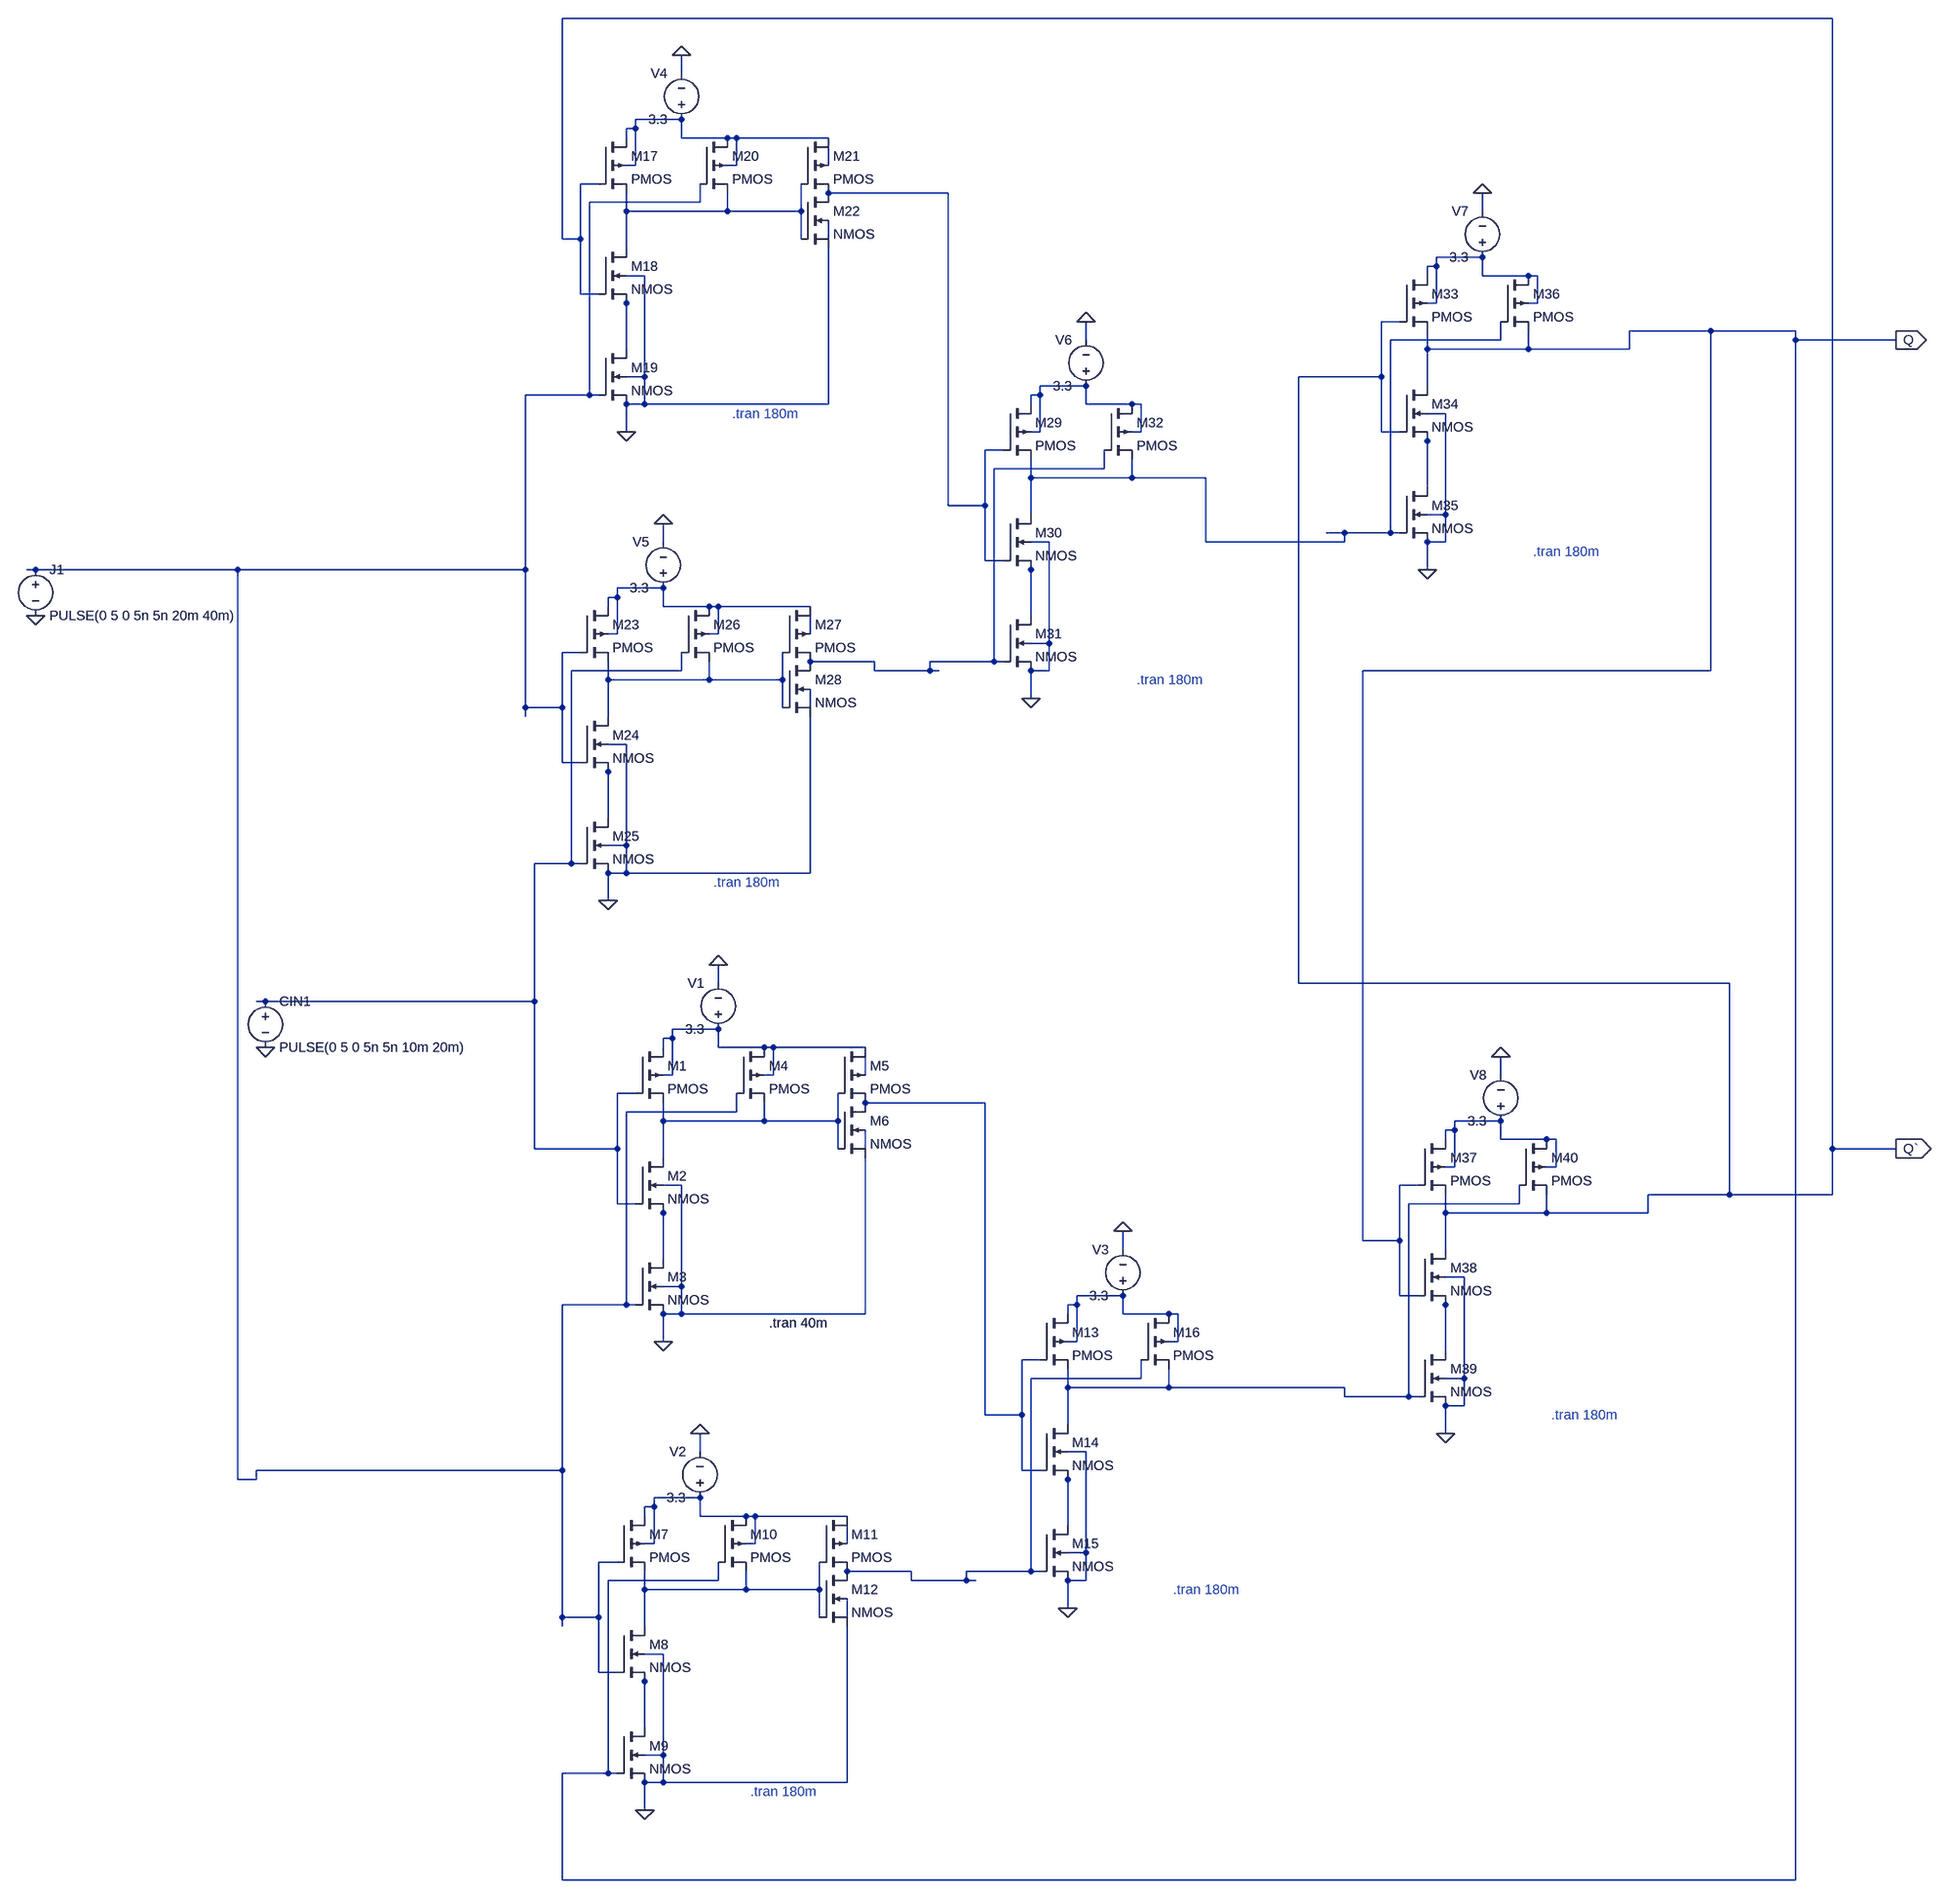
[diagram p0: schematic TFF.asc]
TFF.asc, the LTspice schematic file:
Version 4
SHEET 1 880 3060
WIRE -384 -304 -2832 -304
WIRE -2624 -208 -2624 -240
WIRE -2624 -128 -2704 -128
WIRE -2704 -112 -2704 -128
WIRE -2704 -112 -2720 -112
WIRE -2720 -96 -2720 -112
WIRE -2624 -96 -2624 -128
WIRE -2544 -96 -2624 -96
WIRE -2528 -96 -2544 -96
WIRE -2368 -96 -2528 -96
WIRE -2704 -48 -2704 -112
WIRE -2704 -48 -2720 -48
WIRE -2528 -48 -2528 -96
WIRE -2528 -48 -2544 -48
WIRE -2368 -48 -2368 -80
WIRE -2768 -16 -2800 -16
WIRE -2160 0 -2368 0
WIRE -2592 16 -2592 -16
WIRE -2592 16 -2784 16
WIRE -2720 32 -2720 0
WIRE -2544 32 -2544 0
WIRE -2544 32 -2720 32
WIRE -2416 32 -2416 -16
WIRE -2416 32 -2544 32
WIRE -1120 32 -1120 0
WIRE -2832 80 -2832 -304
WIRE -2800 80 -2800 -16
WIRE -2800 80 -2832 80
WIRE -2416 80 -2416 32
WIRE -2368 80 -2368 48
WIRE -2720 96 -2720 32
WIRE -1120 112 -1200 112
WIRE -1200 128 -1200 112
WIRE -1200 128 -1216 128
WIRE -2688 144 -2720 144
WIRE -1216 144 -1216 128
WIRE -1120 144 -1120 112
WIRE -1040 144 -1120 144
WIRE -1024 144 -1040 144
WIRE -2800 176 -2800 80
WIRE -2768 176 -2800 176
WIRE -2720 192 -2720 176
WIRE -1200 192 -1200 128
WIRE -1200 192 -1216 192
WIRE -1024 192 -1024 144
WIRE -1024 192 -1040 192
WIRE -1264 224 -1296 224
WIRE -624 240 -864 240
WIRE -448 240 -624 240
WIRE -1920 256 -1920 224
WIRE -1088 256 -1088 224
WIRE -1088 256 -1280 256
WIRE -448 256 -448 240
WIRE -192 256 -448 256
WIRE -2720 272 -2720 192
WIRE -1216 272 -1216 240
WIRE -1040 272 -1040 240
WIRE -1040 272 -1216 272
WIRE -864 272 -864 240
WIRE -864 272 -1040 272
WIRE -2688 320 -2688 144
WIRE -2688 320 -2720 320
WIRE -1296 320 -1296 224
WIRE -1296 320 -1440 320
WIRE -1920 336 -2000 336
WIRE -1216 336 -1216 272
WIRE -2784 352 -2784 16
WIRE -2784 352 -2896 352
WIRE -2768 352 -2784 352
WIRE -2000 352 -2000 336
WIRE -2000 352 -2016 352
WIRE -2688 368 -2688 320
WIRE -2688 368 -2720 368
WIRE -2368 368 -2368 96
WIRE -2368 368 -2688 368
WIRE -2016 368 -2016 352
WIRE -1920 368 -1920 336
WIRE -1840 368 -1920 368
WIRE -1824 368 -1840 368
WIRE -1184 384 -1216 384
WIRE -2720 416 -2720 368
WIRE -2000 416 -2000 352
WIRE -2000 416 -2016 416
WIRE -1824 416 -1824 368
WIRE -1824 416 -1840 416
WIRE -1296 416 -1296 320
WIRE -1264 416 -1296 416
WIRE -1216 432 -1216 416
WIRE -2064 448 -2096 448
WIRE -1888 480 -1888 448
WIRE -1888 480 -2080 480
WIRE -2016 496 -2016 464
WIRE -1840 496 -1840 464
WIRE -1840 496 -2016 496
WIRE -1712 496 -1840 496
WIRE -1216 512 -1216 432
WIRE -2160 544 -2160 0
WIRE -2096 544 -2096 448
WIRE -2096 544 -2160 544
WIRE -2016 560 -2016 496
WIRE -1184 560 -1184 384
WIRE -1184 560 -1216 560
WIRE -1360 592 -1392 592
WIRE -1280 592 -1280 256
WIRE -1280 592 -1360 592
WIRE -1264 592 -1280 592
WIRE -2656 608 -2656 576
WIRE -1984 608 -2016 608
WIRE -1712 608 -1712 496
WIRE -1360 608 -1360 592
WIRE -1360 608 -1712 608
WIRE -1184 608 -1184 560
WIRE -1184 608 -1216 608
WIRE -2096 640 -2096 544
WIRE -2064 640 -2096 640
WIRE -3840 656 -3856 656
WIRE -3488 656 -3840 656
WIRE -2896 656 -2896 352
WIRE -2896 656 -3488 656
WIRE -2016 656 -2016 640
WIRE -1216 656 -1216 608
WIRE -2656 688 -2736 688
WIRE -2736 704 -2736 688
WIRE -2736 704 -2752 704
WIRE -2752 720 -2752 704
WIRE -2656 720 -2656 688
WIRE -2576 720 -2656 720
WIRE -2560 720 -2576 720
WIRE -2400 720 -2560 720
WIRE -2016 736 -2016 656
WIRE -2736 768 -2736 704
WIRE -2736 768 -2752 768
WIRE -2560 768 -2560 720
WIRE -2560 768 -2576 768
WIRE -2400 768 -2400 736
WIRE -1984 784 -1984 608
WIRE -1984 784 -2016 784
WIRE -2800 800 -2832 800
WIRE -2288 816 -2400 816
WIRE -2080 816 -2080 480
WIRE -2080 816 -2192 816
WIRE -2064 816 -2080 816
WIRE -2624 832 -2624 800
WIRE -2624 832 -2816 832
WIRE -2288 832 -2288 816
WIRE -2192 832 -2192 816
WIRE -2192 832 -2288 832
WIRE -2176 832 -2192 832
WIRE -1984 832 -1984 784
WIRE -1984 832 -2016 832
WIRE -624 832 -624 240
WIRE -624 832 -1328 832
WIRE -2752 848 -2752 816
WIRE -2576 848 -2576 816
WIRE -2576 848 -2752 848
WIRE -2448 848 -2448 800
WIRE -2448 848 -2576 848
WIRE -2016 880 -2016 832
WIRE -2896 896 -2896 656
WIRE -2832 896 -2832 800
WIRE -2832 896 -2896 896
WIRE -2448 896 -2448 848
WIRE -2400 896 -2400 864
WIRE -2896 912 -2896 896
WIRE -2752 912 -2752 848
WIRE -2720 960 -2752 960
WIRE -2832 992 -2832 896
WIRE -2800 992 -2832 992
WIRE -2752 1008 -2752 992
WIRE -2752 1088 -2752 1008
WIRE -2720 1136 -2720 960
WIRE -2720 1136 -2752 1136
WIRE -2816 1168 -2816 832
WIRE -2816 1168 -2880 1168
WIRE -2800 1168 -2816 1168
WIRE -2720 1184 -2720 1136
WIRE -2720 1184 -2752 1184
WIRE -2400 1184 -2400 912
WIRE -2400 1184 -2720 1184
WIRE -2752 1232 -2752 1184
WIRE -2560 1376 -2560 1344
WIRE -1440 1376 -1440 320
WIRE -592 1376 -1440 1376
WIRE -3440 1408 -3456 1408
WIRE -2880 1408 -2880 1168
WIRE -2880 1408 -3440 1408
WIRE -2560 1456 -2640 1456
WIRE -2640 1472 -2640 1456
WIRE -2640 1472 -2656 1472
WIRE -2656 1488 -2656 1472
WIRE -2560 1488 -2560 1456
WIRE -2480 1488 -2560 1488
WIRE -2464 1488 -2480 1488
WIRE -2304 1488 -2464 1488
WIRE -2640 1536 -2640 1472
WIRE -2640 1536 -2656 1536
WIRE -2464 1536 -2464 1488
WIRE -2464 1536 -2480 1536
WIRE -2304 1536 -2304 1504
WIRE -1088 1536 -1088 1504
WIRE -2704 1568 -2736 1568
WIRE -2096 1584 -2304 1584
WIRE -2528 1600 -2528 1568
WIRE -2528 1600 -2720 1600
WIRE -2656 1616 -2656 1584
WIRE -2480 1616 -2480 1584
WIRE -2480 1616 -2656 1616
WIRE -2352 1616 -2352 1568
WIRE -2352 1616 -2480 1616
WIRE -1088 1616 -1168 1616
WIRE -1168 1632 -1168 1616
WIRE -1168 1632 -1184 1632
WIRE -1184 1648 -1184 1632
WIRE -1088 1648 -1088 1616
WIRE -1008 1648 -1088 1648
WIRE -992 1648 -1008 1648
WIRE -2880 1664 -2880 1408
WIRE -2736 1664 -2736 1568
WIRE -2736 1664 -2880 1664
WIRE -2352 1664 -2352 1616
WIRE -2304 1664 -2304 1632
WIRE -384 1664 -384 -304
WIRE -192 1664 -384 1664
WIRE -2656 1680 -2656 1616
WIRE -1168 1696 -1168 1632
WIRE -1168 1696 -1184 1696
WIRE -992 1696 -992 1648
WIRE -992 1696 -1008 1696
WIRE -2624 1728 -2656 1728
WIRE -1232 1728 -1264 1728
WIRE -592 1744 -592 1376
WIRE -592 1744 -832 1744
WIRE -384 1744 -384 1664
WIRE -384 1744 -592 1744
WIRE -2736 1760 -2736 1664
WIRE -2704 1760 -2736 1760
WIRE -1056 1760 -1056 1728
WIRE -1056 1760 -1248 1760
WIRE -2656 1776 -2656 1760
WIRE -1184 1776 -1184 1744
WIRE -1008 1776 -1008 1744
WIRE -1008 1776 -1184 1776
WIRE -832 1776 -832 1744
WIRE -832 1776 -1008 1776
WIRE -1328 1824 -1328 832
WIRE -1264 1824 -1264 1728
WIRE -1264 1824 -1328 1824
WIRE -1856 1840 -1856 1808
WIRE -1184 1840 -1184 1776
WIRE -2656 1856 -2656 1776
WIRE -1152 1888 -1184 1888
WIRE -2624 1904 -2624 1728
WIRE -2624 1904 -2656 1904
WIRE -1856 1920 -1936 1920
WIRE -1264 1920 -1264 1824
WIRE -1232 1920 -1264 1920
WIRE -2720 1936 -2720 1600
WIRE -2720 1936 -2832 1936
WIRE -2704 1936 -2720 1936
WIRE -1936 1936 -1936 1920
WIRE -1936 1936 -1952 1936
WIRE -1184 1936 -1184 1920
WIRE -2624 1952 -2624 1904
WIRE -2624 1952 -2656 1952
WIRE -2304 1952 -2304 1680
WIRE -2304 1952 -2624 1952
WIRE -1952 1952 -1952 1936
WIRE -1856 1952 -1856 1920
WIRE -1776 1952 -1856 1952
WIRE -1760 1952 -1776 1952
WIRE -2656 2000 -2656 1952
WIRE -1936 2000 -1936 1936
WIRE -1936 2000 -1952 2000
WIRE -1760 2000 -1760 1952
WIRE -1760 2000 -1776 2000
WIRE -1184 2016 -1184 1936
WIRE -2000 2032 -2032 2032
WIRE -1824 2064 -1824 2032
WIRE -1824 2064 -2016 2064
WIRE -1152 2064 -1152 1888
WIRE -1152 2064 -1184 2064
WIRE -1952 2080 -1952 2048
WIRE -1776 2080 -1776 2048
WIRE -1776 2080 -1952 2080
WIRE -1360 2080 -1776 2080
WIRE -1360 2096 -1360 2080
WIRE -1248 2096 -1248 1760
WIRE -1248 2096 -1360 2096
WIRE -1232 2096 -1248 2096
WIRE -1152 2112 -1152 2064
WIRE -1152 2112 -1184 2112
WIRE -2096 2128 -2096 1584
WIRE -2032 2128 -2032 2032
WIRE -2032 2128 -2096 2128
WIRE -1952 2144 -1952 2080
WIRE -1184 2160 -1184 2112
WIRE -2592 2192 -2592 2160
WIRE -1920 2192 -1952 2192
WIRE -2832 2224 -2832 1936
WIRE -2832 2224 -3456 2224
WIRE -2032 2224 -2032 2128
WIRE -2000 2224 -2032 2224
WIRE -3488 2240 -3488 656
WIRE -3456 2240 -3456 2224
WIRE -3456 2240 -3488 2240
WIRE -1952 2240 -1952 2224
WIRE -2592 2272 -2672 2272
WIRE -2672 2288 -2672 2272
WIRE -2672 2288 -2688 2288
WIRE -2688 2304 -2688 2288
WIRE -2592 2304 -2592 2272
WIRE -2512 2304 -2592 2304
WIRE -2496 2304 -2512 2304
WIRE -2336 2304 -2496 2304
WIRE -1952 2320 -1952 2240
WIRE -2672 2352 -2672 2288
WIRE -2672 2352 -2688 2352
WIRE -2496 2352 -2496 2304
WIRE -2496 2352 -2512 2352
WIRE -2336 2352 -2336 2320
WIRE -1920 2368 -1920 2192
WIRE -1920 2368 -1952 2368
WIRE -2736 2384 -2768 2384
WIRE -2224 2400 -2336 2400
WIRE -2016 2400 -2016 2064
WIRE -2016 2400 -2128 2400
WIRE -2000 2400 -2016 2400
WIRE -2560 2416 -2560 2384
WIRE -2560 2416 -2752 2416
WIRE -2224 2416 -2224 2400
WIRE -2128 2416 -2128 2400
WIRE -2128 2416 -2224 2416
WIRE -2112 2416 -2128 2416
WIRE -1920 2416 -1920 2368
WIRE -1920 2416 -1952 2416
WIRE -2688 2432 -2688 2400
WIRE -2512 2432 -2512 2400
WIRE -2512 2432 -2688 2432
WIRE -2384 2432 -2384 2384
WIRE -2384 2432 -2512 2432
WIRE -1952 2464 -1952 2416
WIRE -2832 2480 -2832 2224
WIRE -2768 2480 -2768 2384
WIRE -2768 2480 -2832 2480
WIRE -2384 2480 -2384 2432
WIRE -2336 2480 -2336 2448
WIRE -2832 2496 -2832 2480
WIRE -2688 2496 -2688 2432
WIRE -2656 2544 -2688 2544
WIRE -2768 2576 -2768 2480
WIRE -2736 2576 -2768 2576
WIRE -2688 2592 -2688 2576
WIRE -2688 2672 -2688 2592
WIRE -2656 2720 -2656 2544
WIRE -2656 2720 -2688 2720
WIRE -2752 2752 -2752 2416
WIRE -2752 2752 -2832 2752
WIRE -2736 2752 -2752 2752
WIRE -2656 2768 -2656 2720
WIRE -2656 2768 -2688 2768
WIRE -2336 2768 -2336 2496
WIRE -2336 2768 -2656 2768
WIRE -2688 2816 -2688 2768
WIRE -2832 3056 -2832 2752
WIRE -448 3056 -448 256
WIRE -448 3056 -2832 3056
FLAG -2656 2000 0
FLAG -2560 1344 0
FLAG -2688 2816 0
FLAG -2592 2160 0
FLAG -1952 2464 0
FLAG -1856 1808 0
FLAG -2720 416 0
FLAG -2624 -240 0
FLAG -2752 1232 0
FLAG -2656 576 0
FLAG -2016 880 0
FLAG -1920 224 0
FLAG -1216 656 0
FLAG -1120 0 0
FLAG -1184 2160 0
FLAG -1088 1504 0
FLAG -3840 736 0
FLAG -3440 1488 0
FLAG -192 256 Q
IOPIN -192 256 Out
FLAG -192 1664 Q`
IOPIN -192 1664 Out
SYMBOL pmos4 -2704 1488 R0
SYMATTR InstName M1
SYMATTR Value2 l=1040nm w=1040nm
SYMBOL nmos4 -2704 1680 R0
SYMATTR InstName M2
SYMATTR Value2 l=1040nm w=1040nm
SYMBOL nmos4 -2704 1856 R0
SYMATTR InstName M3
SYMATTR Value2 l=1040nm w=1040nm
SYMBOL voltage -2560 1472 R180
WINDOW 0 24 96 Left 2
WINDOW 3 24 16 Left 2
WINDOW 123 0 0 Left 0
WINDOW 39 0 0 Left 0
SYMATTR InstName V1
SYMATTR Value 3.3
SYMBOL pmos4 -2528 1488 R0
SYMATTR InstName M4
SYMBOL pmos4 -2352 1488 R0
SYMATTR InstName M5
SYMBOL nmos4 -2352 1584 R0
SYMATTR InstName M6
SYMBOL pmos4 -2736 2304 R0
SYMATTR InstName M7
SYMATTR Value2 l=1040nm w=1040nm
SYMBOL nmos4 -2736 2496 R0
SYMATTR InstName M8
SYMATTR Value2 l=1040nm w=1040nm
SYMBOL nmos4 -2736 2672 R0
SYMATTR InstName M9
SYMATTR Value2 l=1040nm w=1040nm
SYMBOL voltage -2592 2288 R180
WINDOW 0 24 96 Left 2
WINDOW 3 24 16 Left 2
WINDOW 123 0 0 Left 0
WINDOW 39 0 0 Left 0
SYMATTR InstName V2
SYMATTR Value 3.3
SYMBOL pmos4 -2560 2304 R0
SYMATTR InstName M10
SYMBOL pmos4 -2384 2304 R0
SYMATTR InstName M11
SYMBOL nmos4 -2384 2400 R0
SYMATTR InstName M12
SYMBOL pmos4 -2000 1952 R0
SYMATTR InstName M13
SYMATTR Value2 l=1040nm w=1040nm
SYMBOL nmos4 -2000 2144 R0
SYMATTR InstName M14
SYMATTR Value2 l=1040nm w=1040nm
SYMBOL nmos4 -2000 2320 R0
SYMATTR InstName M15
SYMATTR Value2 l=1040nm w=1040nm
SYMBOL voltage -1856 1936 R180
WINDOW 0 24 96 Left 2
WINDOW 3 24 16 Left 2
WINDOW 123 0 0 Left 0
WINDOW 39 0 0 Left 0
SYMATTR InstName V3
SYMATTR Value 3.3
SYMBOL pmos4 -1824 1952 R0
SYMATTR InstName M16
SYMBOL pmos4 -2768 -96 R0
SYMATTR InstName M17
SYMATTR Value2 l=1040nm w=1040nm
SYMBOL nmos4 -2768 96 R0
SYMATTR InstName M18
SYMATTR Value2 l=1040nm w=1040nm
SYMBOL nmos4 -2768 272 R0
SYMATTR InstName M19
SYMATTR Value2 l=1040nm w=1040nm
SYMBOL voltage -2624 -112 R180
WINDOW 0 24 96 Left 2
WINDOW 3 24 16 Left 2
WINDOW 123 0 0 Left 0
WINDOW 39 0 0 Left 0
SYMATTR InstName V4
SYMATTR Value 3.3
SYMBOL pmos4 -2592 -96 R0
SYMATTR InstName M20
SYMBOL pmos4 -2416 -96 R0
SYMATTR InstName M21
SYMBOL nmos4 -2416 0 R0
SYMATTR InstName M22
SYMBOL pmos4 -2800 720 R0
SYMATTR InstName M23
SYMATTR Value2 l=1040nm w=1040nm
SYMBOL nmos4 -2800 912 R0
SYMATTR InstName M24
SYMATTR Value2 l=1040nm w=1040nm
SYMBOL nmos4 -2800 1088 R0
SYMATTR InstName M25
SYMATTR Value2 l=1040nm w=1040nm
SYMBOL voltage -2656 704 R180
WINDOW 0 24 96 Left 2
WINDOW 3 24 16 Left 2
WINDOW 123 0 0 Left 0
WINDOW 39 0 0 Left 0
SYMATTR InstName V5
SYMATTR Value 3.3
SYMBOL pmos4 -2624 720 R0
SYMATTR InstName M26
SYMBOL pmos4 -2448 720 R0
SYMATTR InstName M27
SYMBOL nmos4 -2448 816 R0
SYMATTR InstName M28
SYMBOL pmos4 -2064 368 R0
SYMATTR InstName M29
SYMATTR Value2 l=1040nm w=1040nm
SYMBOL nmos4 -2064 560 R0
SYMATTR InstName M30
SYMATTR Value2 l=1040nm w=1040nm
SYMBOL nmos4 -2064 736 R0
SYMATTR InstName M31
SYMATTR Value2 l=1040nm w=1040nm
SYMBOL voltage -1920 352 R180
WINDOW 0 24 96 Left 2
WINDOW 3 24 16 Left 2
WINDOW 123 0 0 Left 0
WINDOW 39 0 0 Left 0
SYMATTR InstName V6
SYMATTR Value 3.3
SYMBOL pmos4 -1888 368 R0
SYMATTR InstName M32
SYMBOL pmos4 -1264 144 R0
SYMATTR InstName M33
SYMATTR Value2 l=1040nm w=1040nm
SYMBOL nmos4 -1264 336 R0
SYMATTR InstName M34
SYMATTR Value2 l=1040nm w=1040nm
SYMBOL nmos4 -1264 512 R0
SYMATTR InstName M35
SYMATTR Value2 l=1040nm w=1040nm
SYMBOL voltage -1120 128 R180
WINDOW 0 24 96 Left 2
WINDOW 3 24 16 Left 2
WINDOW 123 0 0 Left 0
WINDOW 39 0 0 Left 0
SYMATTR InstName V7
SYMATTR Value 3.3
SYMBOL pmos4 -1088 144 R0
SYMATTR InstName M36
SYMBOL pmos4 -1232 1648 R0
SYMATTR InstName M37
SYMATTR Value2 l=1040nm w=1040nm
SYMBOL nmos4 -1232 1840 R0
SYMATTR InstName M38
SYMATTR Value2 l=1040nm w=1040nm
SYMBOL nmos4 -1232 2016 R0
SYMATTR InstName M39
SYMATTR Value2 l=1040nm w=1040nm
SYMBOL voltage -1088 1632 R180
WINDOW 0 24 96 Left 2
WINDOW 3 24 16 Left 2
WINDOW 123 0 0 Left 0
WINDOW 39 0 0 Left 0
SYMATTR InstName V8
SYMATTR Value 3.3
SYMBOL pmos4 -1056 1648 R0
SYMATTR InstName M40
SYMBOL voltage -3840 640 R0
WINDOW 123 0 0 Left 0
WINDOW 39 0 0 Left 0
SYMATTR InstName J1
SYMATTR Value PULSE(0 5 0 5n 5n 20m 40m)
SYMBOL voltage -3440 1392 R0
WINDOW 123 0 0 Left 0
WINDOW 39 0 0 Left 0
SYMATTR InstName CIN1
SYMATTR Value PULSE(0 5 0 5n 5n 10m 20m)
TEXT -2472 1968 Left 2 !.tran 40m
TEXT -2504 2784 Left 2 ;.tran 180m
TEXT -1768 2432 Left 2 ;.tran 180m
TEXT -2536 384 Left 2 ;.tran 180m
TEXT -2568 1200 Left 2 ;.tran 180m
TEXT -1832 848 Left 2 ;.tran 180m
TEXT -1032 624 Left 2 ;.tran 180m
TEXT -1000 2128 Left 2 ;.tran 180m

The netlist it stands for:
* TFF.asc
M1 N020 N016 N023 N020 PMOS l=1040nm w=1040nm
M2 N023 N016 N027 0 NMOS l=1040nm w=1040nm
M3 N027 N004 0 0 NMOS l=1040nm w=1040nm
V1 N020 0 3.3
M4 N020 N004 N023 N020 PMOS
M5 N020 N023 N022 N021 PMOS
M6 N022 N023 0 N025 NMOS
M7 N032 N004 N034 N032 PMOS l=1040nm w=1040nm
M8 N034 N004 N036 0 NMOS l=1040nm w=1040nm
M9 N036 Q 0 0 NMOS l=1040nm w=1040nm
V2 N032 0 3.3
M10 N032 Q N034 N032 PMOS
M11 N032 N034 N030 N033 PMOS
M12 N030 N034 0 N035 NMOS
M13 N028 N022 N026 N028 PMOS l=1040nm w=1040nm
M14 N026 N022 N031 0 NMOS l=1040nm w=1040nm
M15 N031 N030 0 0 NMOS l=1040nm w=1040nm
V3 N028 0 3.3
M16 N028 N030 N026 N028 PMOS
M17 N001 Q` N005 N001 PMOS l=1040nm w=1040nm
M18 N005 Q` N008 0 NMOS l=1040nm w=1040nm
M19 N008 N004 0 0 NMOS l=1040nm w=1040nm
V4 N001 0 3.3
M20 N001 N004 N005 N001 PMOS
M21 N001 N005 N003 N002 PMOS
M22 N003 N005 0 N006 NMOS
M23 N014 N004 N017 N014 PMOS l=1040nm w=1040nm
M24 N017 N004 N019 0 NMOS l=1040nm w=1040nm
M25 N019 N016 0 0 NMOS l=1040nm w=1040nm
V5 N014 0 3.3
M26 N014 N016 N017 N014 PMOS
M27 N014 N017 N012 N015 PMOS
M28 N012 N017 0 N018 NMOS
M29 N010 N003 N009 N010 PMOS l=1040nm w=1040nm
M30 N009 N003 N013 0 NMOS l=1040nm w=1040nm
M31 N013 N012 0 0 NMOS l=1040nm w=1040nm
V6 N010 0 3.3
M32 N010 N012 N009 N010 PMOS
M33 N007 Q` Q N007 PMOS l=1040nm w=1040nm
M34 Q Q` N011 0 NMOS l=1040nm w=1040nm
M35 N011 N009 0 0 NMOS l=1040nm w=1040nm
V7 N007 0 3.3
M36 N007 N009 Q N007 PMOS
M37 N024 Q Q` N024 PMOS l=1040nm w=1040nm
M38 Q` Q N029 0 NMOS l=1040nm w=1040nm
M39 N029 N026 0 0 NMOS l=1040nm w=1040nm
V8 N024 0 3.3
M40 N024 N026 Q` N024 PMOS
V§J1 N004 0 PULSE(0 5 0 5n 5n 20m 40m)
V§CIN1 N016 0 PULSE(0 5 0 5n 5n 10m 20m)
.model NMOS NMOS
.model PMOS PMOS
.lib standard.mos
.tran 40m
* .tran 180m
* .tran 180m
* .tran 180m
* .tran 180m
* .tran 180m
* .tran 180m
* .tran 180m
.backanno
.end